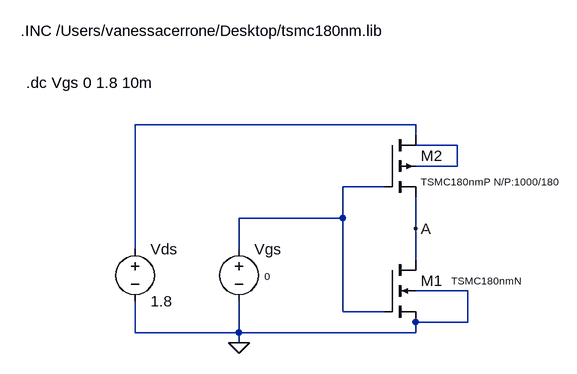
[diagram p0: schematic simulation.asc]
simulation.asc, the LTspice schematic file:
Version 4
SHEET 1 880 796
WIRE 352 240 -80 240
WIRE 352 256 352 240
WIRE 416 272 352 272
WIRE 416 304 416 272
WIRE 416 304 352 304
WIRE 304 336 240 336
WIRE 240 384 240 336
WIRE 240 384 80 384
WIRE 352 400 352 352
WIRE -80 432 -80 240
WIRE 80 432 80 384
WIRE 352 448 352 400
WIRE 432 496 352 496
WIRE 240 528 240 384
WIRE 304 528 240 528
WIRE 432 544 432 496
WIRE 432 544 352 544
WIRE -80 560 -80 512
WIRE 80 560 80 512
WIRE 80 560 -80 560
WIRE 352 560 352 544
WIRE 352 560 80 560
WIRE 80 576 80 560
FLAG 80 576 0
FLAG 352 400 A
SYMBOL voltage -80 416 R0
SYMATTR InstName Vds
SYMATTR Value 1.8
SYMBOL voltage 80 416 R0
WINDOW 3 44 68 Bottom 1
SYMATTR Value 0
SYMATTR InstName Vgs
SYMBOL nmos4 304 448 R0
WINDOW 3 103 32 Left 1
SYMATTR InstName M1
SYMATTR Value TSMC180nmN
SYMATTR Value2 l=1u w=180n
SYMBOL pmos4 304 256 R0
WINDOW 3 56 72 Left 1
SYMATTR InstName M2
SYMATTR Value TSMC180nmP N/P:1000/180
SYMATTR Value2 l=1u w=180n
TEXT -256 96 Left 2 !.INC /Users/vanessacerrone/Desktop/tsmc180nm.lib
TEXT -248 176 Left 2 !.dc Vgs 0 1.8 10m

The netlist it stands for:
* simulation.asc
Vds N001 0 1.8
Vgs N003 0 0
M1 A N003 0 0 TSMC180nmN l=1u w=180n
M2 N001 N003 A N002 TSMC180nmP N/P:1000/180 l=1u w=180n
.model NMOS NMOS
.model PMOS PMOS
.lib standard.mos
.INC /Users/vanessacerrone/Desktop/tsmc180nm.lib
.dc Vgs 0 1.8 10m
.backanno
.end